# Altium schematic sheet Fri3D_2026_Peripherals.SchDoc: Peripherals
size A3; Date: 27/02/2026; DrawnBy: Wim Van Gool; DocumentNumber: 3; Revision: 01; SheetNumber: 3; SheetTotal: 5
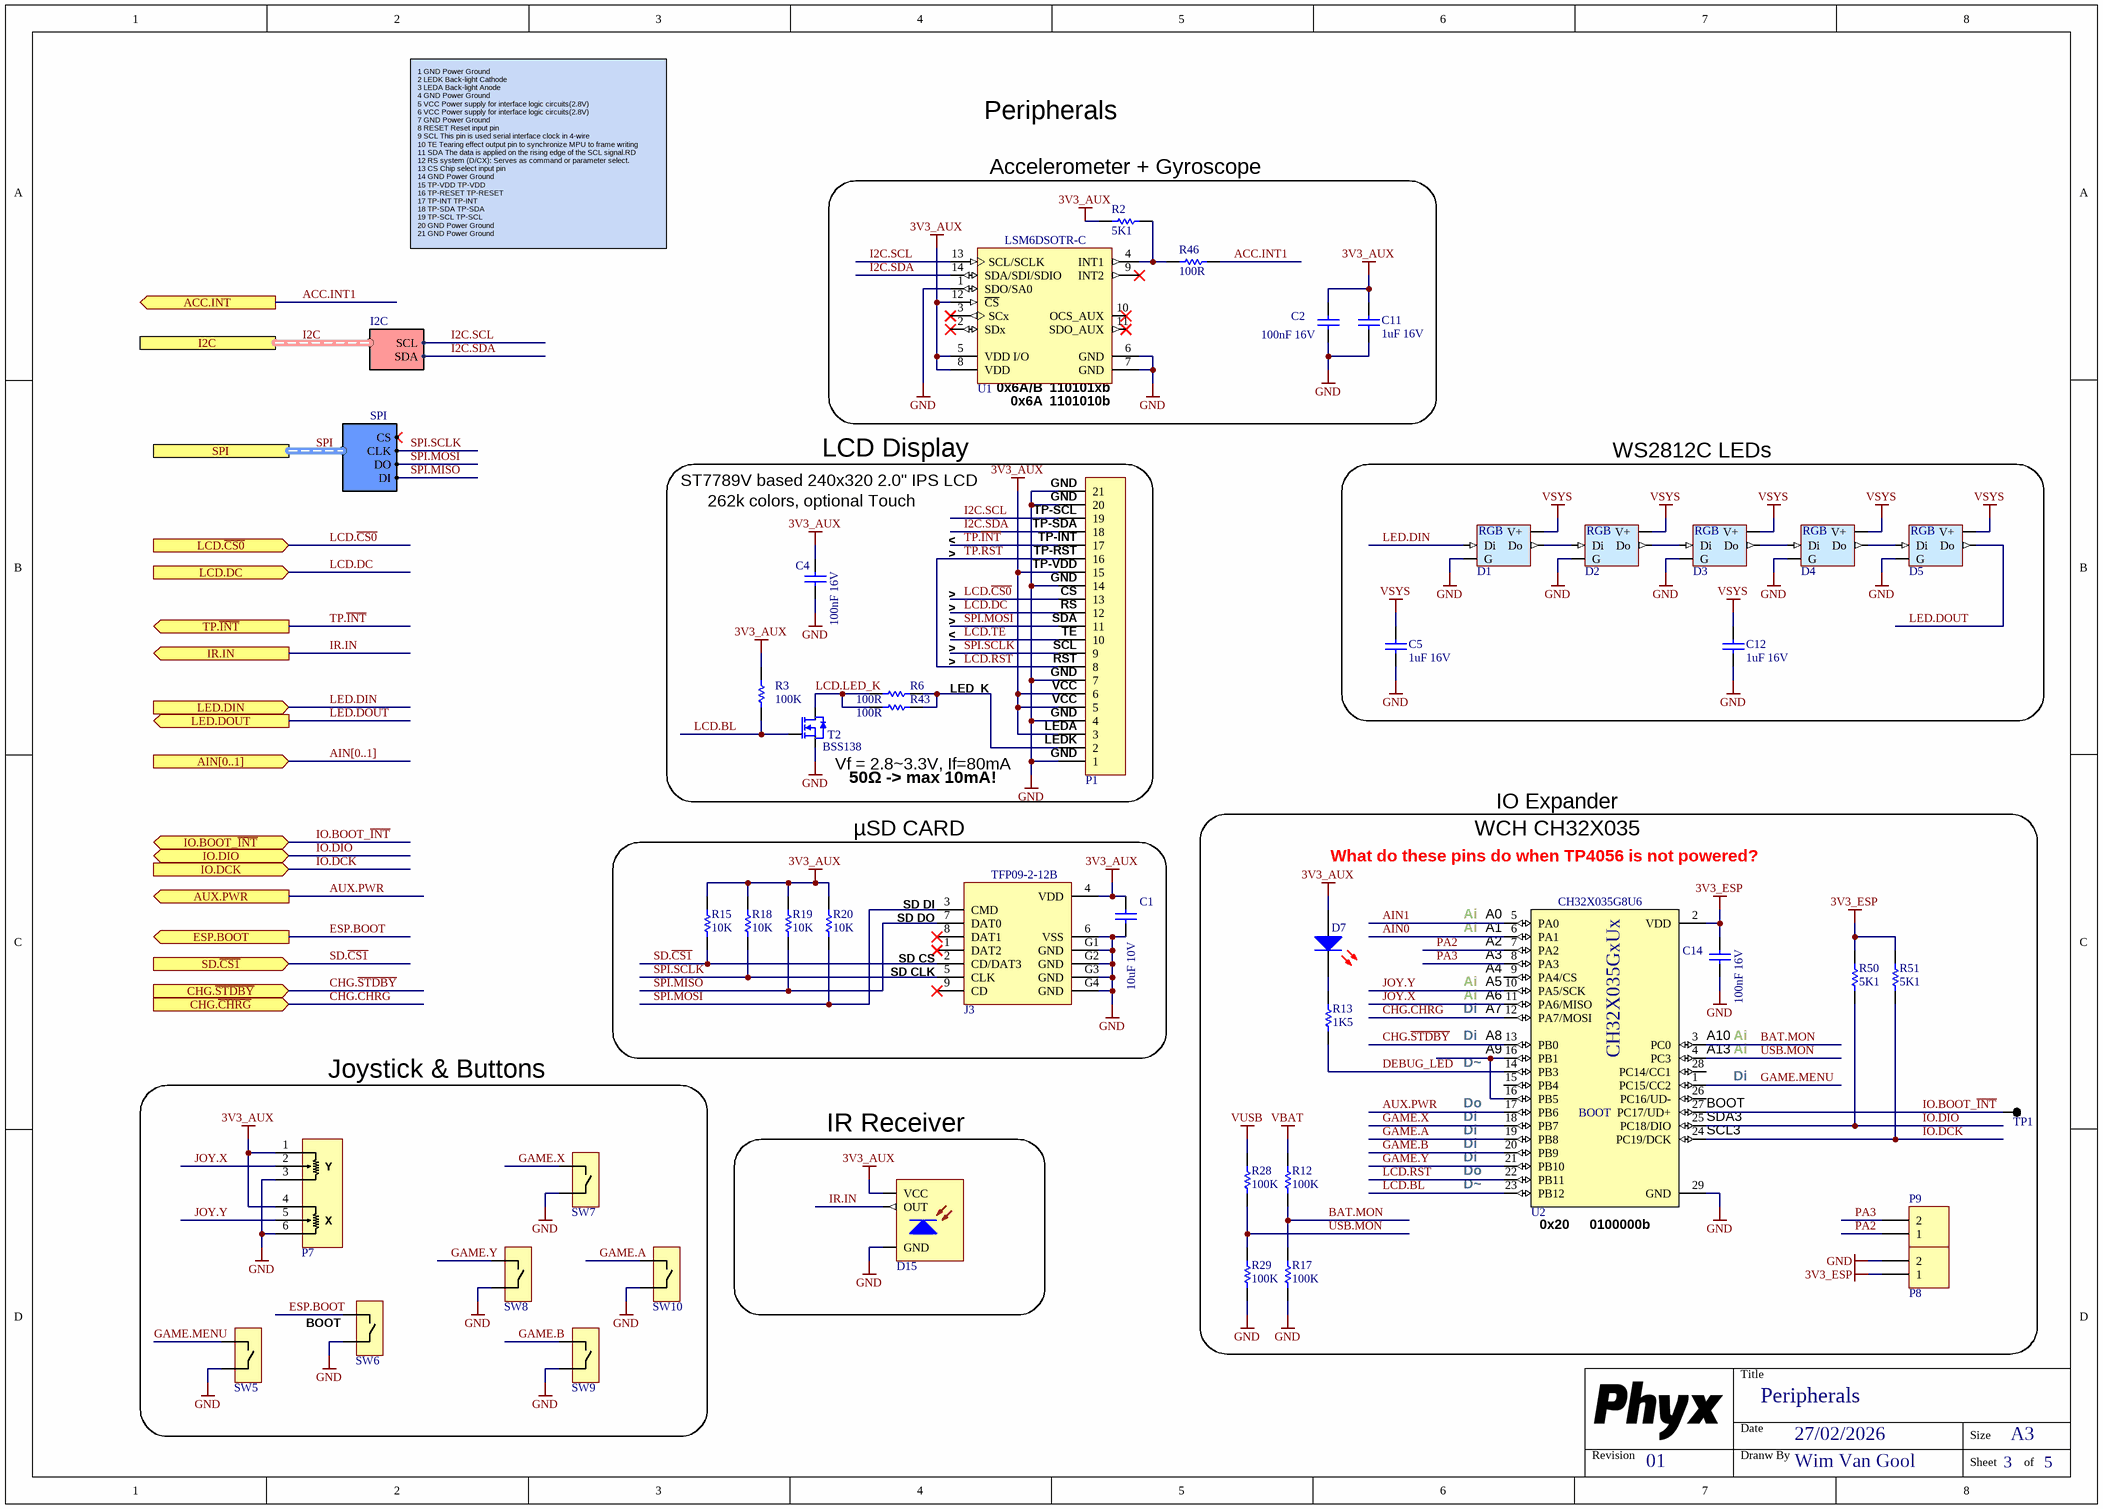
[diagram p0: Fri3D_2026_Peripherals.SchDoc]

## Parts
C1  value 10uF 10V  [C0805_N]
C2  value 100nF 16V  [C0603_N]
C4  value 100nF 16V  [C0603_N]
C5  value 1uF 16V  [C0603_N]
C11  value 1uF 16V  [C0603_N]
C12  value 1uF 16V  [C0603_N]
C14  value 100nF 16V  [C0603_N]
D1  WS2812 based digital RGB LED 5050 White package reduced current  [LED_5050_WS2812B_WHITE]  (value not drawn)
D2  WS2812 based digital RGB LED 5050 White package reduced current  [LED_5050_WS2812B_WHITE]  (value not drawn)
D3  WS2812 based digital RGB LED 5050 White package reduced current  [LED_5050_WS2812B_WHITE]  (value not drawn)
D4  WS2812 based digital RGB LED 5050 White package reduced current  [LED_5050_WS2812B_WHITE]  (value not drawn)
D5  WS2812 based digital RGB LED 5050 White package reduced current  [LED_5050_WS2812B_WHITE]  (value not drawn)
D7  Default 0805 Red LED  [LED_0805_RD]  (value not drawn)
D15  ZIRM-5042B-42-Z2 Infrared Receiver 38 kHz 45° 2.7-5.5V 940nm  [CHAU_ZIRM-5042B-42-Z2]  (value not drawn)
J3  Micro SD PiPo Push-Push  [TFP09-2-12B]  (value not drawn)
P1  FH35C-21S-0.3SHW Top and Bottom Contacts 0.3mm 21pin  [HRS_FH35C-21S-0.3SHW]  (value not drawn)
P7  PSP Mini Joystick  [PSP_Mini_Joystick]  (value not drawn)
P8  Header 2  [HDR1X2]  (value not drawn)
P9  Header 2  [HDR1X2]  (value not drawn)
R2  value 5K1  [R0603_N]
R3  value 100K  [R0603_N]
R6  value 100R  [R0603_N]
R12  value 100K  [R0603_N]
R13  value 1K5  [R0603_N]
R15  value 10K  [R0603_N]
R17  value 100K  [R0603_N]
R18  value 10K  [R0603_N]
R19  value 10K  [R0603_N]
R20  value 10K  [R0603_N]
R28  value 100K  [R0603_N]
R29  value 100K  [R0603_N]
R43  value 100R  [R0603_N]
R46  value 100R  [R0603_N]
R50  value 5K1  [R0603_N]
R51  value 5K1  [R0603_N]
SW5  SKPMAME010 6x6 TACTG Switch  [ALPS_SKPMAME010]  (value not drawn)
SW6  SKPMAME010 6x6 TACTG Switch  [ALPS_SKPMAME010]  (value not drawn)
SW7  SKPMAME010 6x6 TACTG Switch  [ALPS_SKPMAME010]  (value not drawn)
SW8  SKPMAME010 6x6 TACTG Switch  [ALPS_SKPMAME010]  (value not drawn)
SW9  SKPMAME010 6x6 TACTG Switch  [ALPS_SKPMAME010]  (value not drawn)
SW10  SKPMAME010 6x6 TACTG Switch  [ALPS_SKPMAME010]  (value not drawn)
T2  value BSS138  [SOT23-3]  (hidden comment: 0.2A N-Ch MOSFET Vgs 3.2)
TP1  TEST_PAD  [TP_1.5mm_0.9mm]  (value not drawn)
U1  value LSM6DSOTR-C  [STM_LGA14_2.5x3]  (hidden comment: Acceleration ±2, ±4, ±8, ±16g Gyro ±125, ±250, ±500, ±1000, ±2000dps)
U2  value CH32X035G8U6  [QFN_28_4.0x4.0_P0.4]  (hidden comment: WCH CH32X035G8U6 QFN28 RISC-V 32-bit MCU, 62KB Flash, 10KB RAM, USB PD)

## Blocks framed on the sheet
Accelerometer + Gyroscope: C2 C11 R2 R46 U1
LCD Display: C4 P1 R3 R6 R43 T2
WS2812C LEDs: C5 C12 D1-D5
µSD CARD: C1 J3 R15 R18-R20
Joystick & Buttons: P7 SW5-SW10
IR Receiver: D15

## Ports
ACC.INT (out), AIN[0..1] (in), AUX.PWR (out), CHG.~{CHRG} (in), CHG.~{STDBY} (in), ESP.BOOT (out), I2C (harness I2C), IO.BOOT_~{INT} (bidir), IO.DCK (in), IO.DIO (bidir), IR.IN (out), LCD.DC (in), LCD.~{CS0} (in), LED.DIN (in), LED.DOUT (out), SD.~{CS1} (in), SPI (harness SPI), TP.~{INT} (out)

## Harnesses
I2C: SDA, SCL
SPI: CS, CLK, DO, DI

## Nets
3V3_AUX: C1.1 C2.1 C4.1 C11.1 D7.1(A) D15.3(VCC) J3.4(VDD) P1.3 P1.5 P1.6 P1.15 P7.1 P7.4 R2.1 R3.1 R15.1 R18.1 R19.1 R20.1 U1.5(VDD_I/O) U1.8(VDD) U1.12(~{CS})
3V3_ESP: C14.1 P8.1 R50.1 R51.1 U2.2(VDD)
GND: C1.2 C2.2 C4.2 C5.2 C11.2 C12.2 C14.2 D1.3(G) D2.3(G) D3.3(G) D4.3(G) D5.3(G) D15.2(GND) J3.6(VSS) J3.G1(GND) J3.G2(GND) J3.G3(GND) J3.G4(GND) P1.1 P1.4 P1.7 P1.14 P1.20 P1.21 P7.3 P7.6 P8.2 R17.2 R29.2 SW5.2 SW6.2 SW7.2 SW8.2 SW9.2 SW10.2 T2.2(S) U1.1(SDO/SA0) U1.6(GND) U1.7(GND) U2.29(GND)
VBAT: R12.1
VSYS: C5.1 C12.1 D1.1(V+) D2.1(V+) D3.1(V+) D4.1(V+) D5.1(V+)
VUSB: R28.1
ACC.INT1: R46.2 ; port ACC.INT
AIN0: U2.6(PA1)
AIN1: U2.5(PA0)
AUX.PWR: U2.17(PB6) ; port AUX.PWR
BAT.MON: R12.2 R17.1 U2.3(PC0)
CHG.~{CHRG}: U2.12(PA7/MOSI) ; port CHG.~{CHRG}
CHG.~{STDBY}: U2.13(PB0) ; port CHG.~{STDBY}
DEBUG_LED: R13.2 U2.14(PB3)
ESP.BOOT: SW6.1 ; port ESP.BOOT
GAME.A: SW10.1 U2.19(PB8)
GAME.B: SW9.1 U2.20(PB9)
GAME.MENU: SW5.1 U2.1(PC15/CC2)
GAME.X: SW7.1 U2.18(PB7)
GAME.Y: SW8.1 U2.21(PB10)
I2C.SCL: P1.19 U1.13(SCL/SCLK) ; port I2C.SCL
I2C.SDA: P1.18 U1.14(SDA/SDI/SDIO) ; port I2C.SDA
IO.BOOT_~{INT}: TP1.1 U2.27(PC17/UD+) ; port IO.BOOT_~{INT}
IO.DCK: R51.2 U2.24(PC19/DCK) ; port IO.DCK
IO.DIO: R50.2 U2.25(PC18/DIO) ; port IO.DIO
IR.IN: D15.1(OUT) ; port IR.IN
JOY.X: P7.2 U2.11(PA6/MISO)
JOY.Y: P7.5 U2.10(PA5/SCK)
LCD.BL: R3.2 T2.1(G) U2.23(PB12)
LCD.~{CS0}: P1.13 ; port LCD.~{CS0}
LCD.DC: P1.12 ; port LCD.DC
LCD.LED_K: R6.2 R43.2 T2.3(D)
LCD.~{RST}: P1.8 P1.16 U2.22(PB11)  [also labelled TP.RST]
LCD.TE: P1.10
LED.DIN: D1.4(Di) ; port LED.DIN
LED.DOUT: D5.2(Do) ; port LED.DOUT
PA2: P9.1 U2.7(PA2)
PA3: P9.2 U2.8(PA3)
SD.~{CS1}: J3.2(CD/DAT3) R15.2 ; port SD.~{CS1}
SPI.MISO: J3.7(DAT0) R19.2 ; port SPI.DI  [project net SPI.DI]
SPI.MOSI: J3.3(CMD) P1.11 R20.2 ; port SPI.DO  [project net SPI.DO]
SPI.SCLK: J3.5(CLK) P1.9 R18.2 ; port SPI.CLK  [project net SPI.CLK]
TP.~{INT}: P1.17 ; port TP.~{INT}
USB.MON: R28.2 R29.1 U2.4(PC3)
NetD1_2: D1.2(Do) D2.4(Di)
NetD2_2: D2.2(Do) D3.4(Di)
NetD3_2: D3.2(Do) D4.4(Di)
NetD4_2: D4.2(Do) D5.4(Di)
NetD7_2: D7.2(K) R13.1
NetP1_2: P1.2 R6.1 R43.1
NetR2_2: R2.2 R46.1 U1.4(INT1)

Not connected (* = marked no-connect by the designer): J3 1(DAT2)* 8(DAT1)* 9(CD)*; U1 2(SDx)* 3(SCx)* 9(INT2)* 10(OCS_AUX)* 11(SDO_AUX)*; U2 9(PA4/CS) 15(PB4) 16(PB1) 26(PC16/UD-) 28(PC14/CC1)

## Buses and harness runs
bus AIN[0..1] = port AIN[0..1]
harness I2C = port I2C
harness SPI = port SPI

## Notes on the sheet
- 1 GND Power Ground
  2 LEDK Back-light Cathode
  3 LEDA Back-light Anode
  4 GND Power Ground
  5 VCC Power supply for interface logic circuits(2.8V)
  6 VCC Power supply for interface logic circuits(2.8V)
  7 GND Power Ground
  8 RESET Reset input pin
  9 SCL This pin is used serial interface clock in 4-wire
  10 TE Tearing effect output pin to synchronize MPU to frame writing
  11 SDA The data is applied on the rising edge of the SCL signal.RD
  12 RS system (D/CX): Serves as command or parameter select.
  13 CS Chip select input pin
  14 GND Power Ground
  15 TP-VDD TP-VDD
  16 TP-RESET TP-RESET
  17 TP-INT TP-INT
  18 TP-SDA TP-SDA
  19 TP-SCL TP-SCL
  20 GND Power Ground
  21 GND Power Ground
- (near U1) 0x6A
- (near U1) 0x6A/B
- (near U1) 1101010b
- (near U1) 110101xb
- ST7789V based 240x320 2.0" IPS LCD
- 262k colors, optional Touch
- (near P1) GND
- (near P1) TP-SCL
- >
- <
- (near P1) TP-SDA
- (near P1) TP-INT
- (near P1) TP-RST
- (near P1) TP-VDD
- (near P1) CS
- (near P1) RS
- (near P1) SDA
- (near P1) TE
- (near P1) SCL
- LED_K
- (near P1) RST
- (near P1) VCC
- (near T2) Vf = 2.8~3.3V, If=80mA
- 50Ω -> max 10mA!
- (near P1) LEDA
- (near P1) LEDK
- IO Expander
- WCH CH32X035
- What do these pins do when TP4056 is not powered?
- (near J3) SD DI
- (near J3) SD DO
- Ai
- (near U2) A0
- (near J3) SD CS
- (near J3) SD CLK
- (near U2) A1
- (near U2) A2
- (near U2) A3
- (near U2) A4
- (near U2) A5
- Di
- (near U2) A6
- (near U2) A7
- (near U2) A8
- (near U2) A9
- (near U2) A10
- (near U2) A13
- D~
- Do
- (near U2) BOOT
- (near U2) SDA3
- (near U2) SCL3
- (near U2) 0x20
- (near U2) 0100000b
- (near SW6) BOOT
- Title
- Revision
- Date
- Dranw By
- Size
- Sheet
- of
- (in symbol JOY # PSP Mini Joystick) Y; X
- (in symbol LED # RGB WS2812C-5050 WH) RGB
- (in symbol RISCV # CH32X035G8U6) CH32X035GxUx; BOOT

## Library data of the parts
C1 = CAP # 10uF 10V 0805: Capacitor Ceramic; Supplier 1: Farnell; Supplier Part Number 1: 2320859; Supplier 2: LCSC; Supplier 3: Generic; Supplier Part Number 2: C17024; Supplier Part Number 3: 10uF 10V 0805 X7R
C2 C4 C14 = CAP # 100nF 16V 0603: Capacitor Ceramic; Supplier 1: LCSC; Supplier 3: Generic; Supplier Part Number 1: C282519; Supplier Part Number 3: 100nF 16V 0603 X7R
C5 C11 C12 = CAP # 1uF 16V 0603: Capacitor Ceramic; Supplier 1: Farnell; Supplier Part Number 1: 2320814; Supplier 2: LCSC; Supplier 3: Generic; Supplier Part Number 2: C1592; Supplier Part Number 3: 1uF 16V 0603 X7R
D1-D5 = LED # RGB WS2812C-5050 WH: =Description; Value: WS218C 5050 WH; Supplier 1: Aliexpress; Supplier Part Number 1: WS2812C Black 5050; Supplier 2: LCSC; Supplier Part Number 2: C114587
D7 = LED # Red 0805: =Description; Supplier 1: Farnell; Supplier Part Number 1: 2099236; Supplier 2: LCSC; Supplier Part Number 2: C965812
D15 = PHO # IR Rx 940nm ZIRM-5042B-42-Z2: =Description; Value: ZIRM-5042B-42-Z2; Supplier 1: LCSC; Supplier Part Number 1: C575386
J3 = MicroSD TFP09-2-12B Push-Push: =Description; Value: TFP09-2-12B; Supplier 1: AliExpress; Supplier Part Number 1: TFP09-2-12B; Supplier 2: LCSC; Supplier 3: LCSC; Supplier Part Number 2: C393941; Supplier Part Number 3: C381082
P1 = ZIF # 0.3mm 21p FH35C-21S-0.3SHW(50): Value: FH35C-21S-0.3SHW(50); Supplier 1: LCSC; Supplier Part Number 1: C5242964; Supplier 2: Digi-key; Supplier Part Number 2: 26-FH35C-21S-0.3SHW(50)CT-ND; Supplier 3: LCSC; Supplier Part Number 3: C48688891
P7 = JOY # PSP Mini Joystick: Value: PSP Mini Joystick; Supplier 1: AliExpress; Supplier Part Number 1: 32958017132; Supplier 2: TaoBao; Supplier Part Number 2: 606257885046
P8 P9 = Pin Header 2.54mm 2way: Supplier 1: LCSC; Supplier Part Number 1: C492401; Supplier 2: LCSC; Supplier Part Number 2: C541856
R2 R50 R51 = RES # 5K1 0603: Supplier 3: Generic; Supplier Part Number 3: 5K1 1% 0603; Supplier 1: Farnell; Supplier Part Number 1: 2845922; Supplier 2: LCSC; Supplier Part Number 2: C112314
R3 R12 R17 R28 R29 = RES # 100K 0603: Supplier 3: Generic; Supplier Part Number 3: 100K 1% 0603; Supplier 1: LCSC; Supplier 2: LCSC; Supplier Part Number 1: C25803; Supplier Part Number 2: C14675
R6 R43 R46 = RES # 100R 0603: Supplier 1: Farnell; Supplier 2: LCSC; Supplier 3: Generic; Supplier Part Number 1: 2446544; Supplier Part Number 2: C22775; Supplier Part Number 3: 100R 1% 0603
R13 = RES # 1K5 0603: Supplier 3: Generic; Supplier Part Number 3: 1K5 1% 0603; Supplier 1: LCSC; Supplier 2: LCSC; Supplier Part Number 1: C2930050; Supplier Part Number 2: C114668
R15 R18-R20 = RES # 10K 0603: Supplier 1: Farnell; Supplier Part Number 1: 2502397; Supplier 2: LCSC; Supplier 3: Generic; Supplier Part Number 2: C25804; Supplier Part Number 3: 10K 1% 0603
SW5-SW10 = SW # TACT ALPS SKPMAME010: Value: SKPMAME010; Supplier 1: LCSC; Supplier Part Number 1: C115348; Supplier 2: Farnell; Supplier Part Number 2: 2056804; Supplier 3: Mouser; Supplier Part Number 3: 688-SKPMAM
T2 = BSS138 N-Ch MOSFET 0.2A 3.2Vgs 60Vds: Supplier 1: Farnell; Supplier Part Number 1: 2432717
TP1 = TP 1.5mm: Value: NO BOM
U1 = ACCELERO GYRO # LSM6DSOTR-C: =Description; Supplier 1: LCSC; Supplier Part Number 1: C2655100; Supplier 2: Mouser; Supplier Part Number 2: 511-LSM6DSOTR; Supplier 3: EBV; Supplier Part Number 3: LSM6DSOTR; Description: ACCELERO GYRO # LSM6DSOTR-C
U2 = RISCV # CH32X035G8U6: Supplier 1: LCSC; Supplier Part Number 1: C7437027